# EAGLE schematic altair (EAGLE 9.4.1)

## Sheet 1 of 2
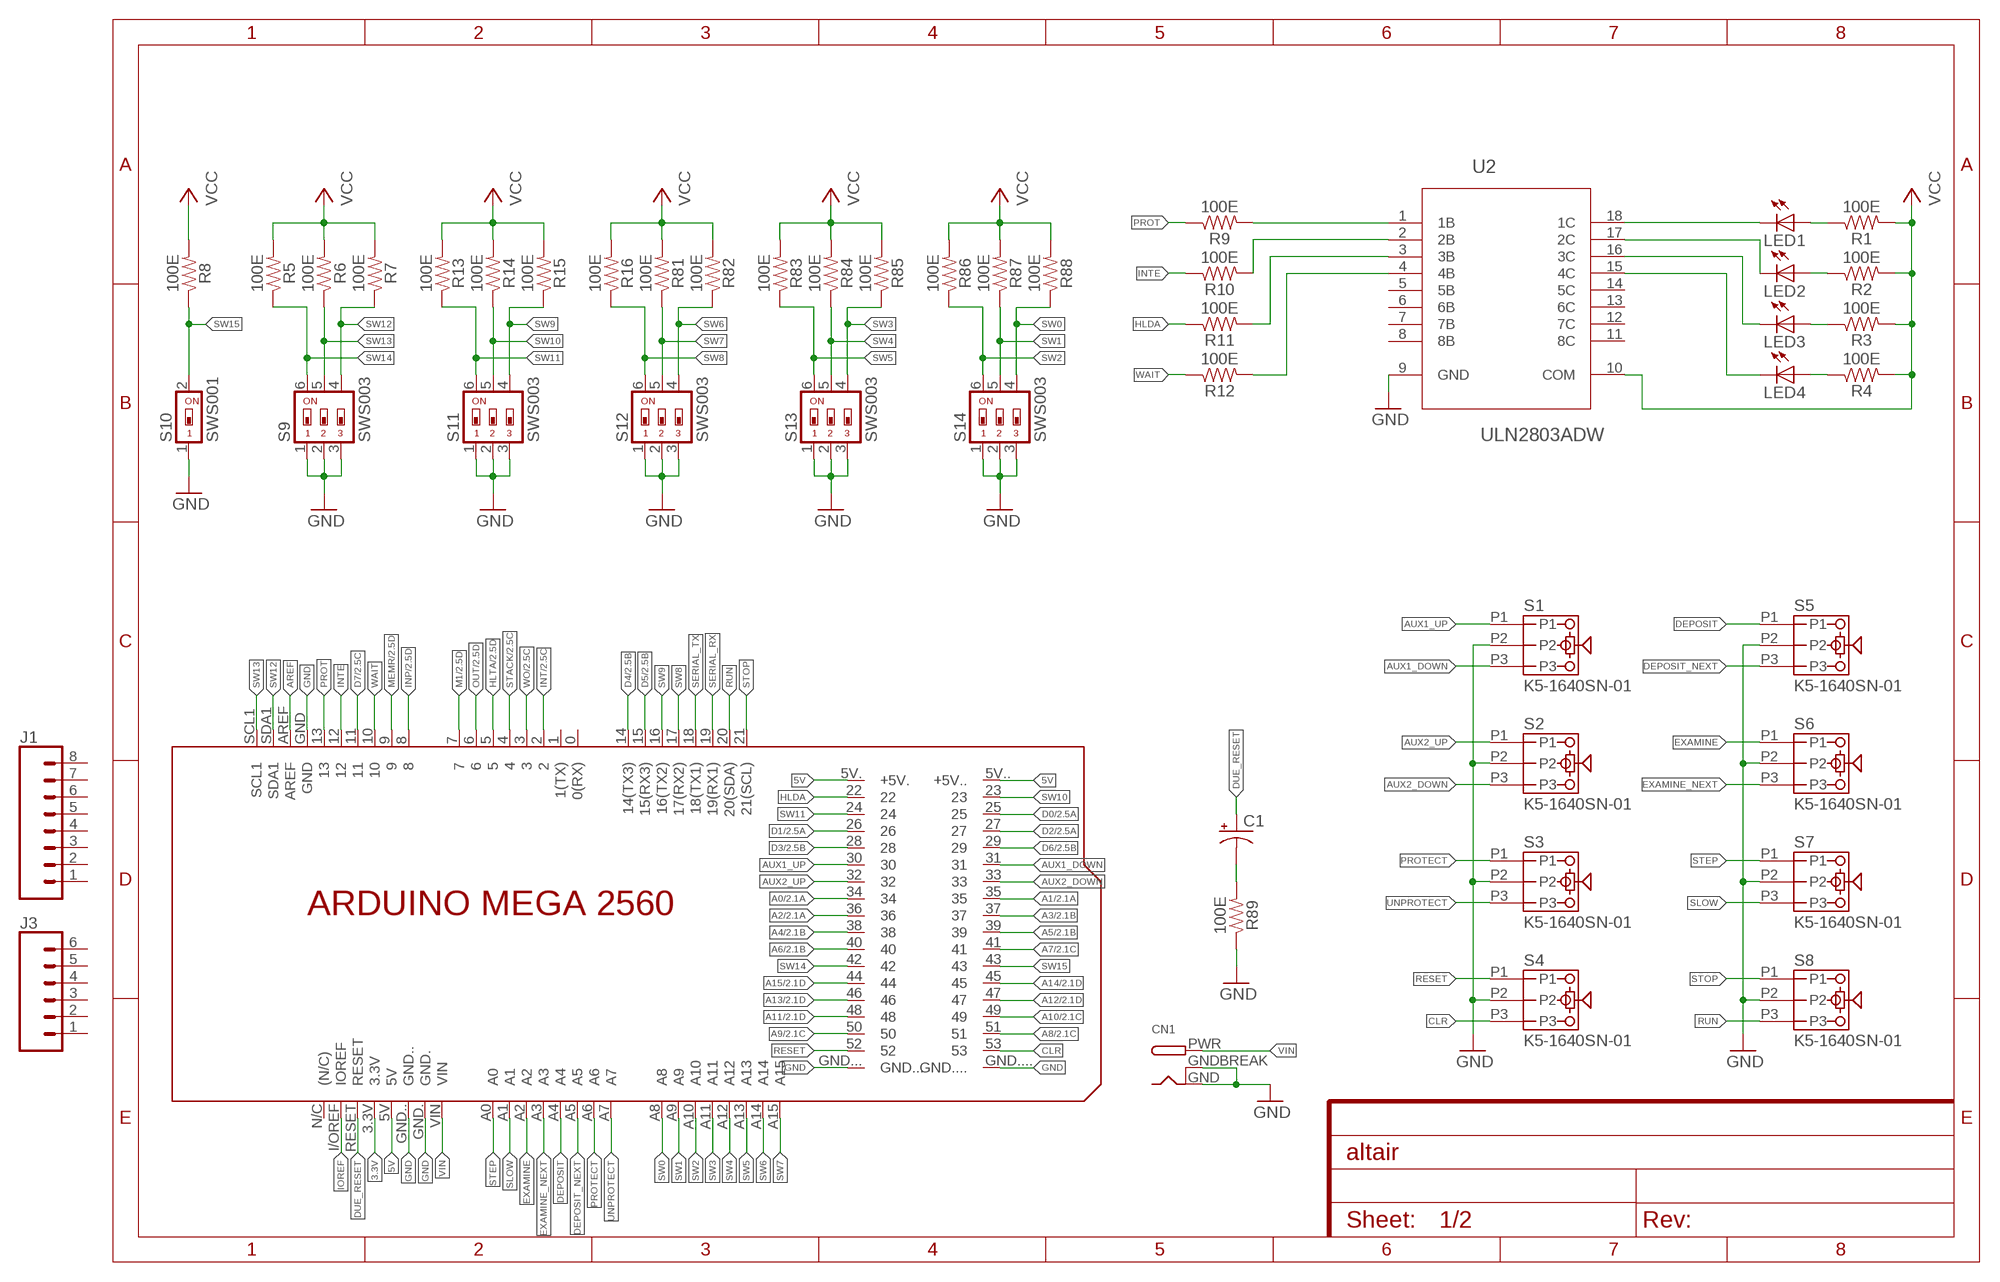
[diagram p0: schematic, sheet 1]

### Parts
C1  CPOL-USD  [PANASONIC_D]
CN1  DCBARRELPTH  [DCJACK_2MM_PTH]
J1  CONN_08LOCK  [1X08_LOCK]
J3  CONN_06LOCK  [1X06_LOCK]
LED1  LEDCHIP-LED0805  [CHIP-LED0805]
LED2  LEDCHIP-LED0805  [CHIP-LED0805]
LED3  LEDCHIP-LED0805  [CHIP-LED0805]
LED4  LEDCHIP-LED0805  [CHIP-LED0805]
PCB2  ARDUINO_MEGA2560  [ARDUINO_MEGA2560]
R1  100E  RESISTOR0805  [0805]
R2  100E  RESISTOR0805  [0805]
R3  100E  RESISTOR0805  [0805]
R4  100E  RESISTOR0805  [0805]
R5  100E  RESISTOR0805  [0805]
R6  100E  RESISTOR0805  [0805]
R7  100E  RESISTOR0805  [0805]
R8  100E  RESISTOR0805  [0805]
R9  100E  RESISTOR0805  [0805]
R10  100E  RESISTOR0805  [0805]
R11  100E  RESISTOR0805  [0805]
R12  100E  RESISTOR0805  [0805]
R13  100E  RESISTOR0805  [0805]
R14  100E  RESISTOR0805  [0805]
R15  100E  RESISTOR0805  [0805]
R16  100E  RESISTOR0805  [0805]
R81  100E  RESISTOR0805  [0805]
R82  100E  RESISTOR0805  [0805]
R83  100E  RESISTOR0805  [0805]
R84  100E  RESISTOR0805  [0805]
R85  100E  RESISTOR0805  [0805]
R86  100E  RESISTOR0805  [0805]
R87  100E  RESISTOR0805  [0805]
R88  100E  RESISTOR0805  [0805]
R89  100E  RESISTOR0805  [0805]
S1  K5-1640SN-01  [K5-1640SN-01]
S2  K5-1640SN-01  [K5-1640SN-01]
S3  K5-1640SN-01  [K5-1640SN-01]
S4  K5-1640SN-01  [K5-1640SN-01]
S5  K5-1640SN-01  [K5-1640SN-01]
S6  K5-1640SN-01  [K5-1640SN-01]
S7  K5-1640SN-01  [K5-1640SN-01]
S8  K5-1640SN-01  [K5-1640SN-01]
S9  SWS003  [SMS-003]
S10  SWS001  [SMS-001]
S11  SWS003  [SMS-003]
S12  SWS003  [SMS-003]
S13  SWS003  [SMS-003]
S14  SWS003  [SMS-003]
U2  ULN2803ADW  [SOIC127P1030X265-18N]

### Nets
3.3V: PCB2.3.3V
5V: PCB2.5V PCB2.5V.(+5V.) PCB2.5V..(+5V..)
A0: PCB2.34 ; also sheet 2
A1: PCB2.35 ; also sheet 2
A2: PCB2.36 ; also sheet 2
A3: PCB2.37 ; also sheet 2
A4: PCB2.38 ; also sheet 2
A5: PCB2.39 ; also sheet 2
A6: PCB2.40 ; also sheet 2
A7: PCB2.41 ; also sheet 2
A8: PCB2.51 ; also sheet 2
A9: PCB2.50 ; also sheet 2
A10: PCB2.49 ; also sheet 2
A11: PCB2.48 ; also sheet 2
A12: PCB2.47 ; also sheet 2
A13: PCB2.46 ; also sheet 2
A14: PCB2.45 ; also sheet 2
A15: PCB2.44 ; also sheet 2
AREF: PCB2.AREF
AUX1_DOWN: PCB2.31 S1.P3
AUX1_UP: PCB2.30 S1.P1
AUX2_DOWN: PCB2.33 S2.P3
AUX2_UP: PCB2.32 S2.P1
CLR: PCB2.53 S4.P3
D0: PCB2.25 ; also sheet 2
D1: PCB2.26 ; also sheet 2
D2: PCB2.27 ; also sheet 2
D3: PCB2.28 ; also sheet 2
D4: PCB2.14(14(TX3)) ; also sheet 2
D5: PCB2.15(15(RX3)) ; also sheet 2
D6: PCB2.29 ; also sheet 2
D7: PCB2.11 ; also sheet 2
DEPOSIT: PCB2.A4 S5.P1
DEPOSIT_NEXT: PCB2.A5 S5.P3
DUE_RESET: C1.+ PCB2.RESET
EXAMINE: PCB2.A2 S6.P1
EXAMINE_NEXT: PCB2.A3 S6.P3
GND: CN1.GND CN1.GNDBREAK PCB2.GND PCB2.GND. PCB2.GND.. PCB2.GND... PCB2.GND.... R89.1 S1.P2 S2.P2 S3.P2 S4.P2 S5.P2 S6.P2 S7.P2 S8.P2 S9.1 S9.2 S9.3 S10.1 S11.1 S11.2 S11.3 S12.1 S12.2 S12.3 S13.1 S13.2 S13.3 S14.1 S14.2 S14.3 U2.9(GND) ; also sheet 2
HLDA: PCB2.22 R11.1
HLTA: PCB2.5 ; also sheet 2
INP: PCB2.8 ; also sheet 2
INT: PCB2.2 ; also sheet 2
INTE: PCB2.12 R10.1
IOREF: PCB2.I/OREF(IOREF)
M1: PCB2.7 ; also sheet 2
MEMR: PCB2.9 ; also sheet 2
N$1: LED1.A R1.1
N$2: LED2.A R2.1
N$3: LED3.A R3.1
N$4: LED4.A R4.1
N$9: LED1.C U2.18(1C)
N$10: LED2.C U2.17(2C)
N$11: LED3.C U2.16(3C)
N$12: LED4.C U2.15(4C)
N$13: C1.- R89.2
N$19: R9.2 U2.1(1B)
N$20: R10.2 U2.2(2B)
N$21: R11.2 U2.3(3B)
N$22: R12.2 U2.4(4B)
OUT: PCB2.6 ; also sheet 2
PROT: PCB2.13 R9.1
PROTECT: PCB2.A6 S3.P1
RESET: PCB2.52 S4.P1
RUN: PCB2.20(20(SDA)) S8.P3
SERIAL_RX: PCB2.19(19(RX1))
SERIAL_TX: PCB2.18(18(TX1))
SLOW: PCB2.A1 S7.P3
STACK: PCB2.4 ; also sheet 2
STEP: PCB2.A0 S7.P1
STOP: PCB2.21(21(SCL)) S8.P1
SW0: PCB2.A8 R88.1 S14.4
SW1: PCB2.A9 R87.1 S14.5
SW2: PCB2.A10 R86.1 S14.6
SW3: PCB2.A11 R85.1 S13.4
SW4: PCB2.A12 R84.1 S13.5
SW5: PCB2.A13 R83.1 S13.6
SW6: PCB2.A14 R82.1 S12.4
SW7: PCB2.A15 R81.1 S12.5
SW8: PCB2.17(17(RX2)) R16.1 S12.6
SW9: PCB2.16(16(TX2)) R15.1 S11.4
SW10: PCB2.23 R14.1 S11.5
SW11: PCB2.24 R13.1 S11.6
SW12: PCB2.SDA1 R7.1 S9.4
SW13: PCB2.SCL1 R6.1 S9.5
SW14: PCB2.42 R5.1 S9.6
SW15: PCB2.43 R8.1 S10.2
UNPROTECT: PCB2.A7 S3.P3
VCC: R1.2 R2.2 R3.2 R4.2 R5.2 R6.2 R7.2 R8.2 R13.2 R14.2 R15.2 R16.2 R81.2 R82.2 R83.2 R84.2 R85.2 R86.2 R87.2 R88.2 U2.10(COM) ; also sheet 2
VIN: CN1.PWR PCB2.VIN
WAIT: PCB2.10 R12.1
WO: PCB2.3 ; also sheet 2
Unconnected: J1.1 J1.2 J1.3 J1.4 J1.5 J1.6 J1.7 J1.8 J3.1 J3.2 J3.3 J3.4 J3.5 J3.6 PCB2.0(0(RX)) PCB2.1(1(TX)) PCB2.N/C((N/C)) U2.5(5B) U2.6(6B) U2.7(7B) U2.8(8B) U2.11(8C) U2.12(7C) U2.13(6C) U2.14(5C)

## Sheet 2 of 2
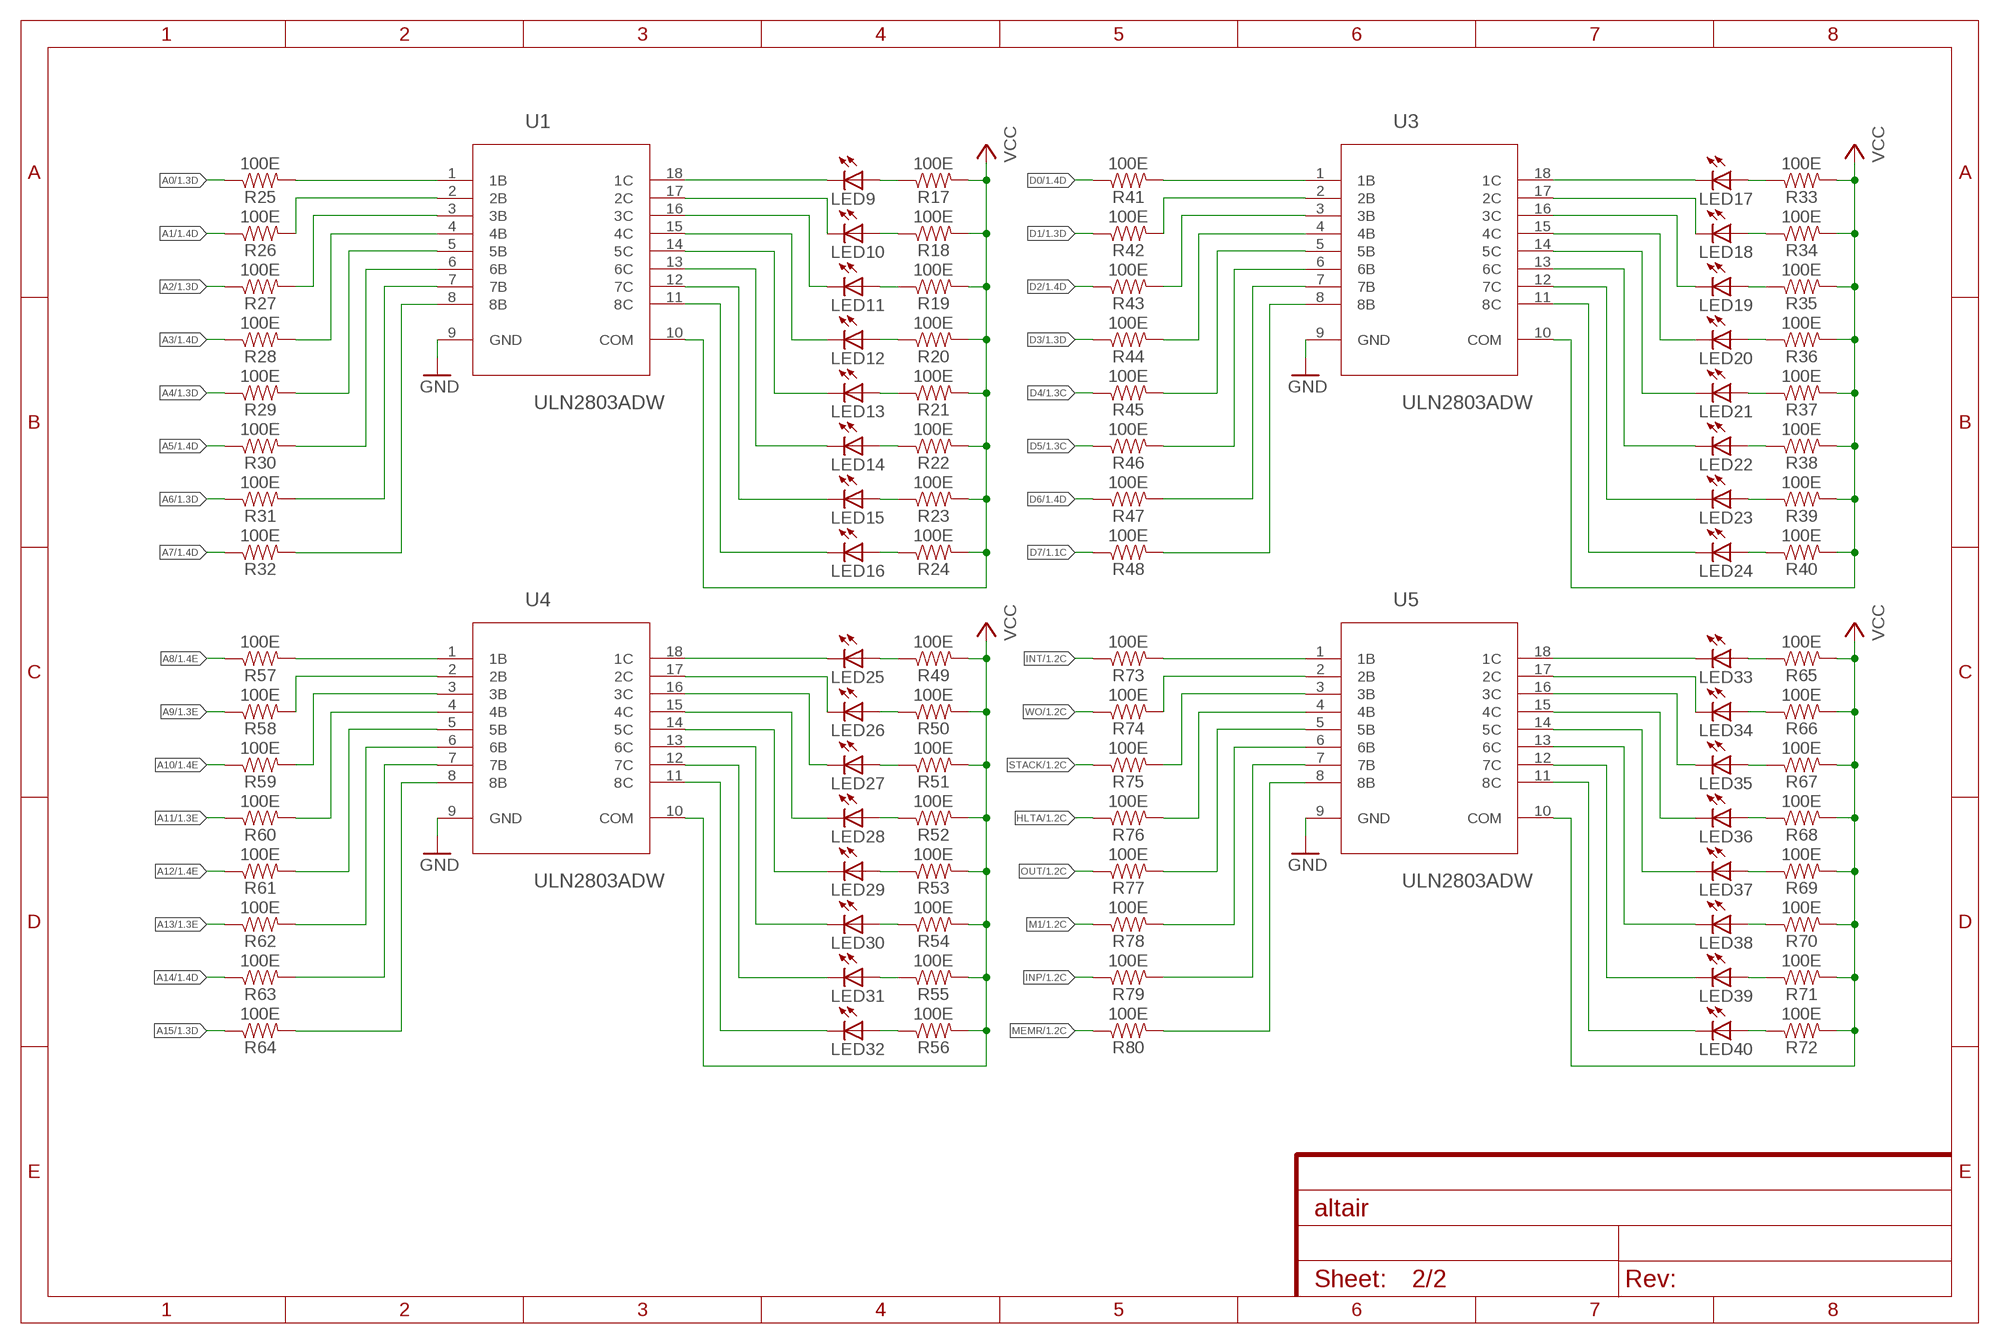
[diagram p1: schematic, sheet 2]

### Parts
LED9  LEDCHIP-LED0805  [CHIP-LED0805]
LED10  LEDCHIP-LED0805  [CHIP-LED0805]
LED11  LEDCHIP-LED0805  [CHIP-LED0805]
LED12  LEDCHIP-LED0805  [CHIP-LED0805]
LED13  LEDCHIP-LED0805  [CHIP-LED0805]
LED14  LEDCHIP-LED0805  [CHIP-LED0805]
LED15  LEDCHIP-LED0805  [CHIP-LED0805]
LED16  LEDCHIP-LED0805  [CHIP-LED0805]
LED17  LEDCHIP-LED0805  [CHIP-LED0805]
LED18  LEDCHIP-LED0805  [CHIP-LED0805]
LED19  LEDCHIP-LED0805  [CHIP-LED0805]
LED20  LEDCHIP-LED0805  [CHIP-LED0805]
LED21  LEDCHIP-LED0805  [CHIP-LED0805]
LED22  LEDCHIP-LED0805  [CHIP-LED0805]
LED23  LEDCHIP-LED0805  [CHIP-LED0805]
LED24  LEDCHIP-LED0805  [CHIP-LED0805]
LED25  LEDCHIP-LED0805  [CHIP-LED0805]
LED26  LEDCHIP-LED0805  [CHIP-LED0805]
LED27  LEDCHIP-LED0805  [CHIP-LED0805]
LED28  LEDCHIP-LED0805  [CHIP-LED0805]
LED29  LEDCHIP-LED0805  [CHIP-LED0805]
LED30  LEDCHIP-LED0805  [CHIP-LED0805]
LED31  LEDCHIP-LED0805  [CHIP-LED0805]
LED32  LEDCHIP-LED0805  [CHIP-LED0805]
LED33  LEDCHIP-LED0805  [CHIP-LED0805]
LED34  LEDCHIP-LED0805  [CHIP-LED0805]
LED35  LEDCHIP-LED0805  [CHIP-LED0805]
LED36  LEDCHIP-LED0805  [CHIP-LED0805]
LED37  LEDCHIP-LED0805  [CHIP-LED0805]
LED38  LEDCHIP-LED0805  [CHIP-LED0805]
LED39  LEDCHIP-LED0805  [CHIP-LED0805]
LED40  LEDCHIP-LED0805  [CHIP-LED0805]
R17  100E  RESISTOR0805  [0805]
R18  100E  RESISTOR0805  [0805]
R19  100E  RESISTOR0805  [0805]
R20  100E  RESISTOR0805  [0805]
R21  100E  RESISTOR0805  [0805]
R22  100E  RESISTOR0805  [0805]
R23  100E  RESISTOR0805  [0805]
R24  100E  RESISTOR0805  [0805]
R25  100E  RESISTOR0805  [0805]
R26  100E  RESISTOR0805  [0805]
R27  100E  RESISTOR0805  [0805]
R28  100E  RESISTOR0805  [0805]
R29  100E  RESISTOR0805  [0805]
R30  100E  RESISTOR0805  [0805]
R31  100E  RESISTOR0805  [0805]
R32  100E  RESISTOR0805  [0805]
R33  100E  RESISTOR0805  [0805]
R34  100E  RESISTOR0805  [0805]
R35  100E  RESISTOR0805  [0805]
R36  100E  RESISTOR0805  [0805]
R37  100E  RESISTOR0805  [0805]
R38  100E  RESISTOR0805  [0805]
R39  100E  RESISTOR0805  [0805]
R40  100E  RESISTOR0805  [0805]
R41  100E  RESISTOR0805  [0805]
R42  100E  RESISTOR0805  [0805]
R43  100E  RESISTOR0805  [0805]
R44  100E  RESISTOR0805  [0805]
R45  100E  RESISTOR0805  [0805]
R46  100E  RESISTOR0805  [0805]
R47  100E  RESISTOR0805  [0805]
R48  100E  RESISTOR0805  [0805]
R49  100E  RESISTOR0805  [0805]
R50  100E  RESISTOR0805  [0805]
R51  100E  RESISTOR0805  [0805]
R52  100E  RESISTOR0805  [0805]
R53  100E  RESISTOR0805  [0805]
R54  100E  RESISTOR0805  [0805]
R55  100E  RESISTOR0805  [0805]
R56  100E  RESISTOR0805  [0805]
R57  100E  RESISTOR0805  [0805]
R58  100E  RESISTOR0805  [0805]
R59  100E  RESISTOR0805  [0805]
R60  100E  RESISTOR0805  [0805]
R61  100E  RESISTOR0805  [0805]
R62  100E  RESISTOR0805  [0805]
R63  100E  RESISTOR0805  [0805]
R64  100E  RESISTOR0805  [0805]
R65  100E  RESISTOR0805  [0805]
R66  100E  RESISTOR0805  [0805]
R67  100E  RESISTOR0805  [0805]
R68  100E  RESISTOR0805  [0805]
R69  100E  RESISTOR0805  [0805]
R70  100E  RESISTOR0805  [0805]
R71  100E  RESISTOR0805  [0805]
R72  100E  RESISTOR0805  [0805]
R73  100E  RESISTOR0805  [0805]
R74  100E  RESISTOR0805  [0805]
R75  100E  RESISTOR0805  [0805]
R76  100E  RESISTOR0805  [0805]
R77  100E  RESISTOR0805  [0805]
R78  100E  RESISTOR0805  [0805]
R79  100E  RESISTOR0805  [0805]
R80  100E  RESISTOR0805  [0805]
U1  ULN2803ADW  [SOIC127P1030X265-18N]
U3  ULN2803ADW  [SOIC127P1030X265-18N]
U4  ULN2803ADW  [SOIC127P1030X265-18N]
U5  ULN2803ADW  [SOIC127P1030X265-18N]

### Nets
A0: R25.1 ; also sheet 1
A1: R26.1 ; also sheet 1
A2: R27.1 ; also sheet 1
A3: R28.1 ; also sheet 1
A4: R29.1 ; also sheet 1
A5: R30.1 ; also sheet 1
A6: R31.1 ; also sheet 1
A7: R32.1 ; also sheet 1
A8: R57.1 ; also sheet 1
A9: R58.1 ; also sheet 1
A10: R59.1 ; also sheet 1
A11: R60.1 ; also sheet 1
A12: R61.1 ; also sheet 1
A13: R62.1 ; also sheet 1
A14: R63.1 ; also sheet 1
A15: R64.1 ; also sheet 1
D0: R41.1 ; also sheet 1
D1: R42.1 ; also sheet 1
D2: R43.1 ; also sheet 1
D3: R44.1 ; also sheet 1
D4: R45.1 ; also sheet 1
D5: R46.1 ; also sheet 1
D6: R47.1 ; also sheet 1
D7: R48.1 ; also sheet 1
GND: U1.9(GND) U3.9(GND) U4.9(GND) U5.9(GND) ; also sheet 1
HLTA: R76.1 ; also sheet 1
INP: R79.1 ; also sheet 1
INT: R73.1 ; also sheet 1
M1: R78.1 ; also sheet 1
MEMR: R80.1 ; also sheet 1
N$17: LED9.A R17.1
N$18: LED10.A R18.1
N$27: LED11.A R19.1
N$28: LED12.A R20.1
N$29: LED13.A R21.1
N$30: LED14.A R22.1
N$31: LED15.A R23.1
N$32: LED16.A R24.1
N$33: LED9.C U1.18(1C)
N$34: LED10.C U1.17(2C)
N$35: LED11.C U1.16(3C)
N$36: LED12.C U1.15(4C)
N$37: LED13.C U1.14(5C)
N$38: LED14.C U1.13(6C)
N$39: LED15.C U1.12(7C)
N$40: LED16.C U1.11(8C)
N$41: R25.2 U1.1(1B)
N$42: R26.2 U1.2(2B)
N$43: R27.2 U1.3(3B)
N$44: R28.2 U1.4(4B)
N$45: R29.2 U1.5(5B)
N$46: R30.2 U1.6(6B)
N$47: R31.2 U1.7(7B)
N$48: R32.2 U1.8(8B)
N$49: LED17.A R33.1
N$50: LED18.A R34.1
N$51: LED19.A R35.1
N$52: LED20.A R36.1
N$53: LED21.A R37.1
N$54: LED22.A R38.1
N$55: LED23.A R39.1
N$56: LED24.A R40.1
N$57: LED17.C U3.18(1C)
N$58: LED18.C U3.17(2C)
N$59: LED19.C U3.16(3C)
N$60: LED20.C U3.15(4C)
N$61: LED21.C U3.14(5C)
N$62: LED22.C U3.13(6C)
N$63: LED23.C U3.12(7C)
N$64: LED24.C U3.11(8C)
N$65: R41.2 U3.1(1B)
N$66: R42.2 U3.2(2B)
N$67: R43.2 U3.3(3B)
N$68: R44.2 U3.4(4B)
N$69: R45.2 U3.5(5B)
N$70: R46.2 U3.6(6B)
N$71: R47.2 U3.7(7B)
N$72: R48.2 U3.8(8B)
N$73: LED25.A R49.1
N$74: LED26.A R50.1
N$75: LED27.A R51.1
N$76: LED28.A R52.1
N$77: LED29.A R53.1
N$78: LED30.A R54.1
N$79: LED31.A R55.1
N$80: LED32.A R56.1
N$81: LED25.C U4.18(1C)
N$82: LED26.C U4.17(2C)
N$83: LED27.C U4.16(3C)
N$84: LED28.C U4.15(4C)
N$85: LED29.C U4.14(5C)
N$86: LED30.C U4.13(6C)
N$87: LED31.C U4.12(7C)
N$88: LED32.C U4.11(8C)
N$89: R57.2 U4.1(1B)
N$90: R58.2 U4.2(2B)
N$91: R59.2 U4.3(3B)
N$92: R60.2 U4.4(4B)
N$93: R61.2 U4.5(5B)
N$94: R62.2 U4.6(6B)
N$95: R63.2 U4.7(7B)
N$96: R64.2 U4.8(8B)
N$97: LED33.A R65.1
N$98: LED34.A R66.1
N$99: LED35.A R67.1
N$100: LED36.A R68.1
N$101: LED37.A R69.1
N$102: LED38.A R70.1
N$103: LED39.A R71.1
N$104: LED40.A R72.1
N$105: LED33.C U5.18(1C)
N$106: LED34.C U5.17(2C)
N$107: LED35.C U5.16(3C)
N$108: LED36.C U5.15(4C)
N$109: LED37.C U5.14(5C)
N$110: LED38.C U5.13(6C)
N$111: LED39.C U5.12(7C)
N$112: LED40.C U5.11(8C)
N$113: R73.2 U5.1(1B)
N$114: R74.2 U5.2(2B)
N$115: R75.2 U5.3(3B)
N$116: R76.2 U5.4(4B)
N$117: R77.2 U5.5(5B)
N$118: R78.2 U5.6(6B)
N$119: R79.2 U5.7(7B)
N$120: R80.2 U5.8(8B)
OUT: R77.1 ; also sheet 1
STACK: R75.1 ; also sheet 1
VCC: R17.2 R18.2 R19.2 R20.2 R21.2 R22.2 R23.2 R24.2 R33.2 R34.2 R35.2 R36.2 R37.2 R38.2 R39.2 R40.2 R49.2 R50.2 R51.2 R52.2 R53.2 R54.2 R55.2 R56.2 R65.2 R66.2 R67.2 R68.2 R69.2 R70.2 R71.2 R72.2 U1.10(COM) U3.10(COM) U4.10(COM) U5.10(COM) ; also sheet 1
WO: R74.1 ; also sheet 1

## Library data of the parts
C1 = adafruit:CPOL-US: POLARIZED CAPACITOR, American symbol
CN1 = adafruit:DCBARREL: 2.0mm DC Barrel Jack DCJACK_2MM_PTH - Through Hole Jack (4UConnector: 05537)
J1 = SparkFun-Connectors:CONN_08: Multi connection point. Often used as Generic Header-pin footprint for 0.1 inch spaced/style header connections On any of the 0.1 inch spaced packages, you can populate with these: Break Away Headers - Straight <https://www.sparkfun.com/products/116> (PRT-00116) Break Away Male Headers - Right Angle <https://www.sparkfun.com/products/553> (PRT-00553) Female Headers <https://www.sparkfun.com/products/115> (PRT-00115) Break Away Headers - Machine Pin <https://www.sparkfun.com/products/117> (PRT-00117) Break Away Female Headers - Swiss Machine Pin <https://www.sparkfun.com/products/743> (PRT-00743) Arduino Stackable Header - 8 Pin <https://www.sparkfun.com/products/9279> (PRT-09279) For SCREWTERMINALS and SPRING TERMINALS visit here: Screw Terimnals on SparkFun.com <https://www.sparkfun.com/search/results?term=Screw+Terminals> (5mm/3.5mm/2.54mm spacing) This device is also useful as a general connection point to wire up your design to another part of your project. Our various solder wires solder well into these plated through hole pads. Hook-Up Wire - Assortment (Stranded, 22 AWG) <https://www.sparkfun.com/products/11375> (PRT-11375) Hook-Up Wire - Assortment (Solid Core, 22 AWG) <https://www.sparkfun.com/products/11367> (PRT-11367) View the entire wire category on our website here <https://www.sparkfun.com/categories/141> Special notes: Molex polarized connector foot print use with SKU : PRT-08231 with associated crimp pins and housings. 1MM SMD Version SKU: PRT-10208 NOTES ON THE VARIANTS LOCK and LOCK_LONGPADS... This footprint was designed to help hold the alignment of a through-hole component (i.e. 6-pin header) while soldering it into place. You may notice that each hole has been shifted either up or down by 0.005 of an inch from it's more standard position (which is a perfectly straight line). This slight alteration caused the pins (the squares in the middle) to touch the edges of the holes. Because they are alternating, it causes a "brace" to hold the component in place. 0.005 has proven to be the perfect amount of "off-center" position when using our standard breakaway headers. Although looks a little odd when you look at the bare footprint, once you have a header in there, the alteration is very hard to notice. Also,if you push a header all the way into place, it is covered up entirely on the bottom side.
J3 = SparkFun-Connectors:CONN_06: Multi connection point. Often used as Generic Header-pin footprint for 0.1 inch spaced/style header connections On any of the 0.1 inch spaced packages, you can populate with these: Break Away Headers - Straight <https://www.sparkfun.com/products/116> (PRT-00116) Break Away Male Headers - Right Angle <https://www.sparkfun.com/products/553> (PRT-00553) Female Headers <https://www.sparkfun.com/products/115> (PRT-00115) Break Away Headers - Machine Pin <https://www.sparkfun.com/products/117> (PRT-00117) Break Away Female Headers - Swiss Machine Pin <https://www.sparkfun.com/products/743> (PRT-00743) Arduino Stackable Header - 6 Pin <https://www.sparkfun.com/products/9280> (PRT-09280) For SCREWTERMINALS and SPRING TERMINALS visit here: Screw Terimnals on SparkFun.com <https://www.sparkfun.com/search/results?term=Screw+Terminals> (5mm/3.5mm/2.54mm spacing) This device is also useful as a general connection point to wire up your design to another part of your project. Our various solder wires solder well into these plated through hole pads. Hook-Up Wire - Assortment (Stranded, 22 AWG) <https://www.sparkfun.com/products/11375> (PRT-11375) Hook-Up Wire - Assortment (Solid Core, 22 AWG) <https://www.sparkfun.com/products/11367> (PRT-11367) View the entire wire category on our website here <https://www.sparkfun.com/categories/141>
LED1-LED4 LED9-LED40 = adafruit:LED: LED OSRAM: - CHIPLED LG R971, LG N971, LY N971, LG Q971, LY Q971, LO R971, LY R971 LH N974, LH R974 LS Q976, LO Q976, LY Q976 LO Q996 - Hyper CHIPLED LW Q18S LB Q993, LB Q99A, LB R99A - SideLED LS A670, LO A670, LY A670, LG A670, LP A670 LB A673, LV A673, LT A673, LW A673 LH A674 LY A675 LS A676, LA A676, LO A676, LY A676, LW A676 LS A679, LY A679, LG A679 - Hyper Micro SIDELED® LS Y876, LA Y876, LO Y876, LY Y876 LT Y87S - SmartLED LW L88C, LW L88S LB L89C, LB L89S, LG L890 LS L89K, LO L89K, LY L89K LS L896, LA L896, LO L896, LY L896 - TOPLED LS T670, LO T670, LY T670, LG T670, LP T670 LSG T670, LSP T670, LSY T670, LOP T670, LYG T670 LG T671, LOG T671, LSG T671 LB T673, LV T673, LT T673, LW T673 LH T674 LS T676, LA T676, LO T676, LY T676, LB T676, LH T676, LSB T676, LW T676 LB T67C, LV T67C, LT T67C, LS T67K, LO T67K, LY T67K, LW E67C LS E67B, LA E67B, LO E67B, LY E67B, LB E67C, LV E67C, LT E67C LW T67C LS T679, LY T679, LG T679 LS T770, LO T770, LY T770, LG T770, LP T770 LB T773, LV T773, LT T773, LW T773 LH T774 LS E675, LA E675, LY E675, LS T675 LS T776, LA T776, LO T776, LY T776, LB T776 LHGB T686 LT T68C, LB T68C - Hyper Mini TOPLED® LB M676 - Mini TOPLED Santana® LG M470 LS M47K, LO M47K, LY M47K Source: http://www.osram.convergy.de/
PCB2 = Mega:ARDUINO_MEGA2560: Device for representing an Arduino Mega 2560 board with a footprint in an EAGLE design. Created by Dave Young for Element14. More EAGLE documentation at: http://www.element14.com/community/community/knode/cadsoft_eagle
R1-R89 = SparkFun-Resistors:RESISTOR: Generic Resistor Package
S1-S8 = K5-1640SN-01:K5-1640SN-01: K5-1640SN-01
S9 S11-S14 = smd-special:SWS003: SMD Dip Switch 3 pol.
S10 = smd-special:SWS001: SMD Dip Switch 1 pol.
U1-U5 = Texas Instruments_By_element14_Batch_1:ULN2803ADW: Darlington transistor array; MPN: ULN2803ADW; OC_FARNELL: 1652419; OC_NEWARK: 69K0711; PACKAGE: SOIC-18; SUPPLIER: TEXAS INSTRUMENTS